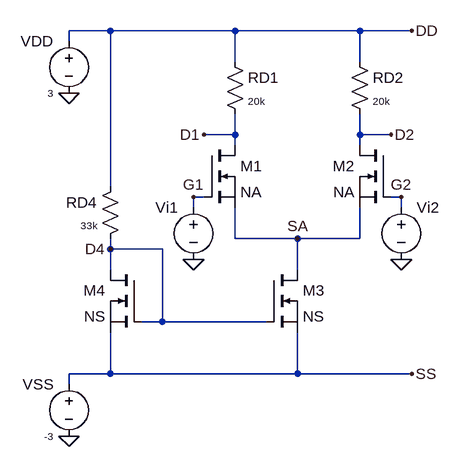
[diagram p0: schematic Circuit.asc]
Circuit.asc, the LTspice schematic file:
Version 4
SHEET 1 880 680
WIRE 64 -80 0 -80
WIRE 256 -80 64 -80
WIRE 448 -80 256 -80
WIRE 528 -80 448 -80
WIRE 0 -64 0 -80
WIRE 256 -32 256 -80
WIRE 448 -32 448 -80
WIRE 256 80 256 48
WIRE 256 80 208 80
WIRE 448 80 448 48
WIRE 496 80 448 80
WIRE 256 96 256 80
WIRE 448 96 448 80
WIRE 64 160 64 -80
WIRE 208 176 192 176
WIRE 512 176 496 176
WIRE 192 192 192 176
WIRE 512 192 512 176
WIRE 256 240 256 192
WIRE 352 240 256 240
WIRE 448 240 448 192
WIRE 448 240 352 240
WIRE 64 256 64 240
WIRE 144 256 64 256
WIRE 64 288 64 256
WIRE 352 288 352 240
WIRE 144 368 144 256
WIRE 144 368 112 368
WIRE 304 368 144 368
WIRE 64 448 64 384
WIRE 64 448 0 448
WIRE 352 448 352 384
WIRE 352 448 64 448
WIRE 528 448 352 448
WIRE 0 464 0 448
FLAG 528 -80 DD
FLAG 528 448 SS
FLAG 352 240 SA
FLAG 208 80 D1
FLAG 496 80 D2
FLAG 0 16 0
FLAG 0 544 0
FLAG 64 256 D4
FLAG 192 272 0
FLAG 512 272 0
FLAG 192 176 G1
FLAG 512 176 G2
SYMBOL nmos 208 96 R0
SYMATTR InstName M1
SYMATTR Value NA
SYMBOL res 240 -48 R0
WINDOW 3 36 76 Left 1
SYMATTR Value 20k
SYMATTR InstName RD1
SYMBOL res 432 -48 R0
WINDOW 3 36 76 Left 1
SYMATTR Value 20k
SYMATTR InstName RD2
SYMBOL nmos 304 288 R0
SYMATTR InstName M3
SYMATTR Value NS
SYMBOL res 80 144 M0
WINDOW 3 36 76 Left 1
SYMATTR Value 33k
SYMATTR InstName RD4
SYMBOL voltage 0 -80 M0
WINDOW 3 24 96 Left 1
SYMATTR Value 3
SYMATTR InstName VDD
SYMBOL voltage 0 448 M0
WINDOW 3 24 96 Left 1
SYMATTR Value -3
SYMATTR InstName VSS
SYMBOL voltage 512 176 R0
WINDOW 3 24 96 Invisible 2
SYMATTR InstName Vi2
SYMBOL nmos 112 288 M0
SYMATTR InstName M4
SYMATTR Value NS
SYMBOL nmos 496 96 M0
SYMATTR InstName M2
SYMATTR Value NA
SYMBOL voltage 192 176 M0
WINDOW 3 24 96 Invisible 2
SYMATTR InstName Vi1

The netlist it stands for:
* Circuit.asc
M1 D1 G1 SA SA NA
RD1 DD D1 20k
RD2 DD D2 20k
M3 SA D4 SS SS NS
RD4 DD D4 33k
VDD DD 0 3
VSS SS 0 -3
Vi2 G2 0 V
M4 D4 D4 SS SS NS
M2 D2 G2 SA SA NA
Vi1 G1 0 V
.model NMOS NMOS
.model PMOS PMOS
.lib standard.mos
.backanno
.end